# Altium project E17-12_CC.PrjPcb
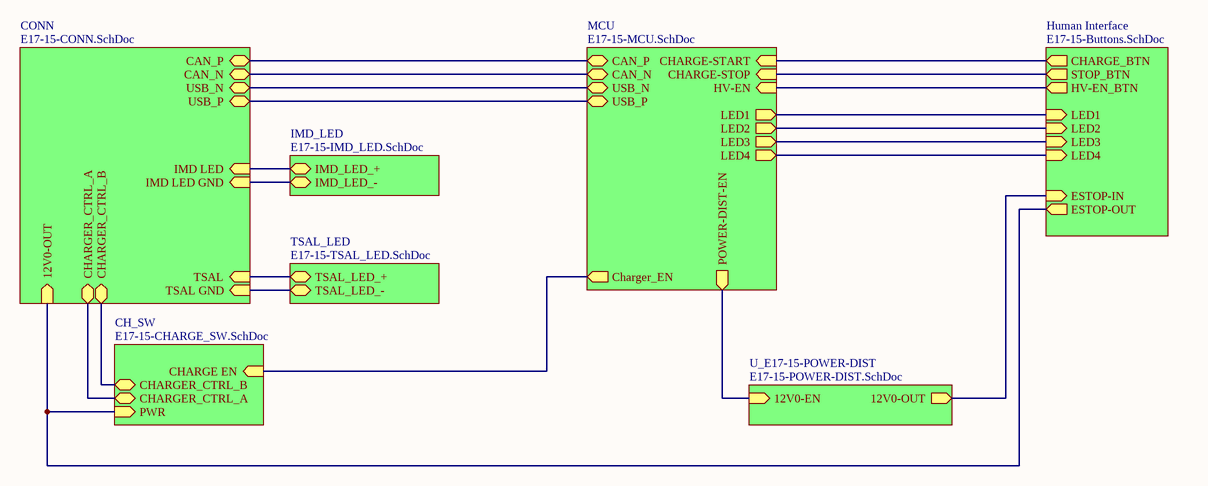
[diagram p0: E17-15-Charge_Cart.SchDoc]
9 sheets, 54 parts. Net scope: hierarchical (ports join the sheet entries above them; power ports are global).
Board file: E17-15-Charge_Cart.PcbDoc
Sheets:
  E17-15-Charge_Cart.SchDoc
    MCU = E17-15-MCU.SchDoc
    CONN = E17-15-CONN.SchDoc
    CH_SW = E17-15-CHARGE_SW.SchDoc
      SW = E17-04-INDUCTIVE_LOAD_SWITCH.SchDoc
    TSAL_LED = E17-15-TSAL_LED.SchDoc
    IMD_LED = E17-15-IMD_LED.SchDoc
    Human Interface = E17-15-Buttons.SchDoc
    U_E17-15-POWER-DIST = E17-15-POWER-DIST.SchDoc
      SW = E17-04-INDUCTIVE_LOAD_SWITCH.SchDoc

## Sheet E17-15-Charge_Cart.SchDoc
size A

### Sub-sheets
CH_SW = E17-15-CHARGE_SW.SchDoc: CHARGE EN (in), CHARGER_CTRL_B (bidir), CHARGER_CTRL_A (bidir), PWR (in)
CONN = E17-15-CONN.SchDoc: IMD LED (in), CAN_P (bidir), CAN_N (bidir), IMD LED GND (in), TSAL GND (in), TSAL (in), CHARGER_CTRL_B (bidir), CHARGER_CTRL_A (bidir), USB_N (bidir), USB_P (bidir), 12V0-OUT (in)
Human Interface = E17-15-Buttons.SchDoc: CHARGE_BTN (out), STOP_BTN (out), HV-EN_BTN (out), ESTOP-IN (in), ESTOP-OUT (out), LED1 (in), LED2 (in), LED3 (in), LED4 (in)
IMD_LED = E17-15-IMD_LED.SchDoc: IMD_LED_+ (bidir), IMD_LED_- (bidir)
MCU = E17-15-MCU.SchDoc: CAN_N (bidir), USB_N (bidir), USB_P (bidir), CAN_P (bidir), Charger_EN (out), CHARGE-STOP (in), HV-EN (in), CHARGE-START (in), POWER-DIST-EN (out), LED1 (out), LED2 (out), LED3 (out), LED4 (out)
TSAL_LED = E17-15-TSAL_LED.SchDoc: TSAL_LED_- (bidir), TSAL_LED_+ (bidir)
U_E17-15-POWER-DIST = E17-15-POWER-DIST.SchDoc: 12V0-OUT (out), 12V0-EN (in)

### Nets
CAN_N: sheet MCU/CAN_N, sheet CONN/CAN_N
CAN_P: sheet MCU/CAN_P, sheet CONN/CAN_P
USB_N: sheet MCU/USB_N, sheet CONN/USB_N
USB_P: sheet MCU/USB_P, sheet CONN/USB_P
NetCONTROL1_SW2_1: sheet MCU/POWER-DIST-EN, sheet U_E17-15-POWER-DIST/12V0-EN
NetD1_SW1_1: sheet CONN/12V0-OUT, sheet CH_SW/PWR, sheet Human Interface/ESTOP-OUT
NetD3_2: sheet CONN/IMD LED GND, sheet IMD_LED/IMD_LED_-
NetD4_2: sheet CONN/TSAL GND, sheet TSAL_LED/TSAL_LED_-
NetJ1_1: sheet CONN/CHARGER_CTRL_A, sheet CH_SW/CHARGER_CTRL_A
NetJ3_1: sheet Human Interface/ESTOP-IN, sheet U_E17-15-POWER-DIST/12V0-OUT
NetJ6_2: sheet CONN/IMD LED, sheet IMD_LED/IMD_LED_+
NetJ6_3: sheet CONN/TSAL, sheet TSAL_LED/TSAL_LED_+
NetJ6_10: sheet CONN/CHARGER_CTRL_B, sheet CH_SW/CHARGER_CTRL_B
NetPB1_40: sheet MCU/LED4, sheet Human Interface/LED4
NetPB1_42: sheet MCU/LED3, sheet Human Interface/LED3
NetPB1_44: sheet MCU/LED2, sheet Human Interface/LED2
NetPB1_46: sheet MCU/LED1, sheet Human Interface/LED1
(unnamed): sheet MCU/Charger_EN, sheet CH_SW/CHARGE EN
(unnamed): sheet MCU/CHARGE-STOP, sheet Human Interface/STOP_BTN
(unnamed): sheet MCU/HV-EN, sheet Human Interface/HV-EN_BTN
(unnamed): sheet MCU/CHARGE-START, sheet Human Interface/CHARGE_BTN

## Sheet E17-15-MCU.SchDoc
size A; DocumentNumber: 2; SheetNumber: 2; SheetTotal: 9
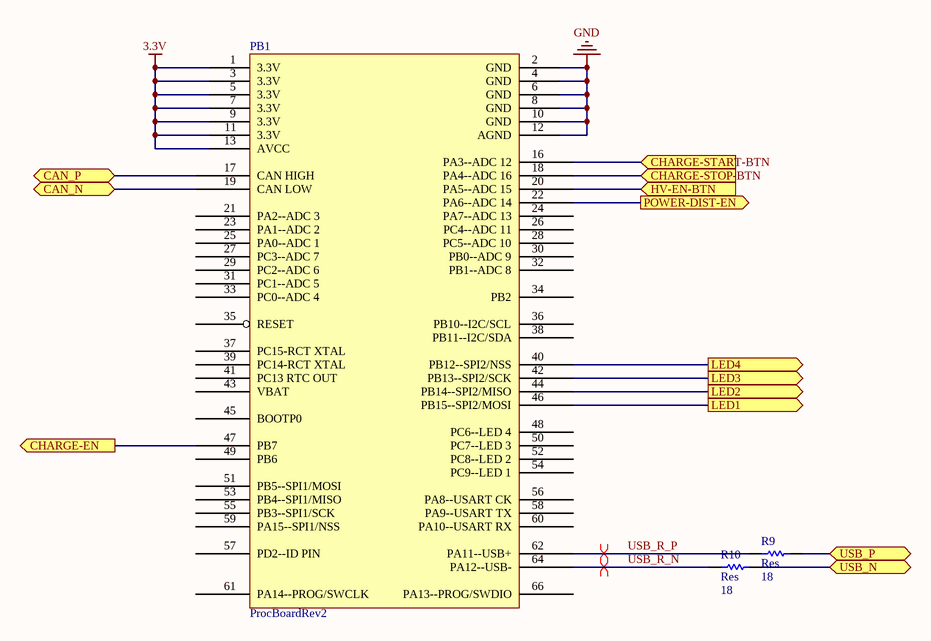
[diagram p1: E17-15-MCU.SchDoc]

### Parts
PB1  ProcBoardRev2  [PROC_BOARD]
R9  Res  value 18  [2012[0805]]
R10  Res  value 18  [2012[0805]]

### Ports
CAN_N (bidir), CAN_P (bidir), CHARGE-EN (out), CHARGE-START-BTN (in), CHARGE-STOP-BTN (in), HV-EN-BTN (in), LED1 (out), LED2 (out), LED3 (out), LED4 (out), POWER-DIST-EN (out), USB_N (bidir), USB_P (bidir)

### Nets
3.3V: PB1.1(3.3V) PB1.3(3.3V) PB1.5(3.3V) PB1.7(3.3V) PB1.9(3.3V) PB1.11(3.3V) PB1.13(AVCC)
GND: PB1.2(GND) PB1.4(GND) PB1.6(GND) PB1.8(GND) PB1.10(GND) PB1.12(AGND)
CAN_N: PB1.19(CAN_LOW) ; port CAN_N
CAN_P: PB1.17(CAN_HIGH) ; port CAN_P
USB_N: R10.2 ; port USB_N
USB_P: R9.2 ; port USB_P
USB_R_N: PB1.64(PA12--USB-) R10.1
USB_R_P: PB1.62(PA11--USB+) R9.1
NetCONTROL1_SW2_1: PB1.22(PA6--ADC_14) ; port POWER-DIST-EN
NetPB1_16: PB1.16(PA3--ADC_12) ; port CHARGE-START-BTN
NetPB1_18: PB1.18(PA4--ADC_16) ; port CHARGE-STOP-BTN
NetPB1_20: PB1.20(PA5--ADC_15) ; port HV-EN-BTN
NetPB1_40: PB1.40(PB12--SPI2/NSS) ; port LED4
NetPB1_42: PB1.42(PB13--SPI2/SCK) ; port LED3
NetPB1_44: PB1.44(PB14--SPI2/MISO) ; port LED2
NetPB1_46: PB1.46(PB15--SPI2/MOSI) ; port LED1
NetPB1_47: PB1.47(PB7) ; port CHARGE-EN

Not connected (* = marked no-connect by the designer): PB1 14(NC) 15(NC) 21(PA2--ADC_3) 23(PA1--ADC_2) 24(PA7--ADC_13) 25(PA0--ADC_1) 26(PC4--ADC_11) 27(PC3--ADC_7) 28(PC5--ADC_10) 29(PC2--ADC_6) 30(PB0--ADC_9) 31(PC1--ADC_5) 32(PB1--ADC_8) 33(PC0--ADC_4) 34(PB2) 35(RESET) 36(PB10--I2C/SCL) 37(PC15-RCT_XTAL) 38(PB11--I2C/SDA) 39(PC14-RCT_XTAL) 41(PC13_RTC_OUT) 43(VBAT) 45(BOOTP0) 48(PC6--LED_4) 49(PB6) 50(PC7--LED_3) 51(PB5--SPI1/MOSI) 52(PC8--LED_2) 53(PB4--SPI1/MISO) 54(PC9--LED_1) 55(PB3--SPI1/SCK) 56(PA8--USART_CK) 57(PD2--ID_PIN) 58(PA9--USART_TX) 59(PA15--SPI1/NSS) 60(PA10--USART_RX) 61(PA14--PROG/SWCLK) 63(NC) 65(NC) 66(PA13--PROG/SWDIO) 67

### Layout directives
differential pair: USB_R_N, USB_R_P

### Library data of the parts
PB1 = ProcBoardRev2: Processor board that carries the STM32F072RB
R9 R10 = Res: Surface Mount Resistor; Published: 8-Jun-2000; LatestRevisionDate: 17-Jul-2002; LatestRevisionNote: Re-released for DXP Platform.; PackageReference: AXIAL-0.5; Publisher: Altium Limited

## Sheet E17-15-CONN.SchDoc
size A; DocumentNumber: 3; SheetNumber: 3; SheetTotal: 9
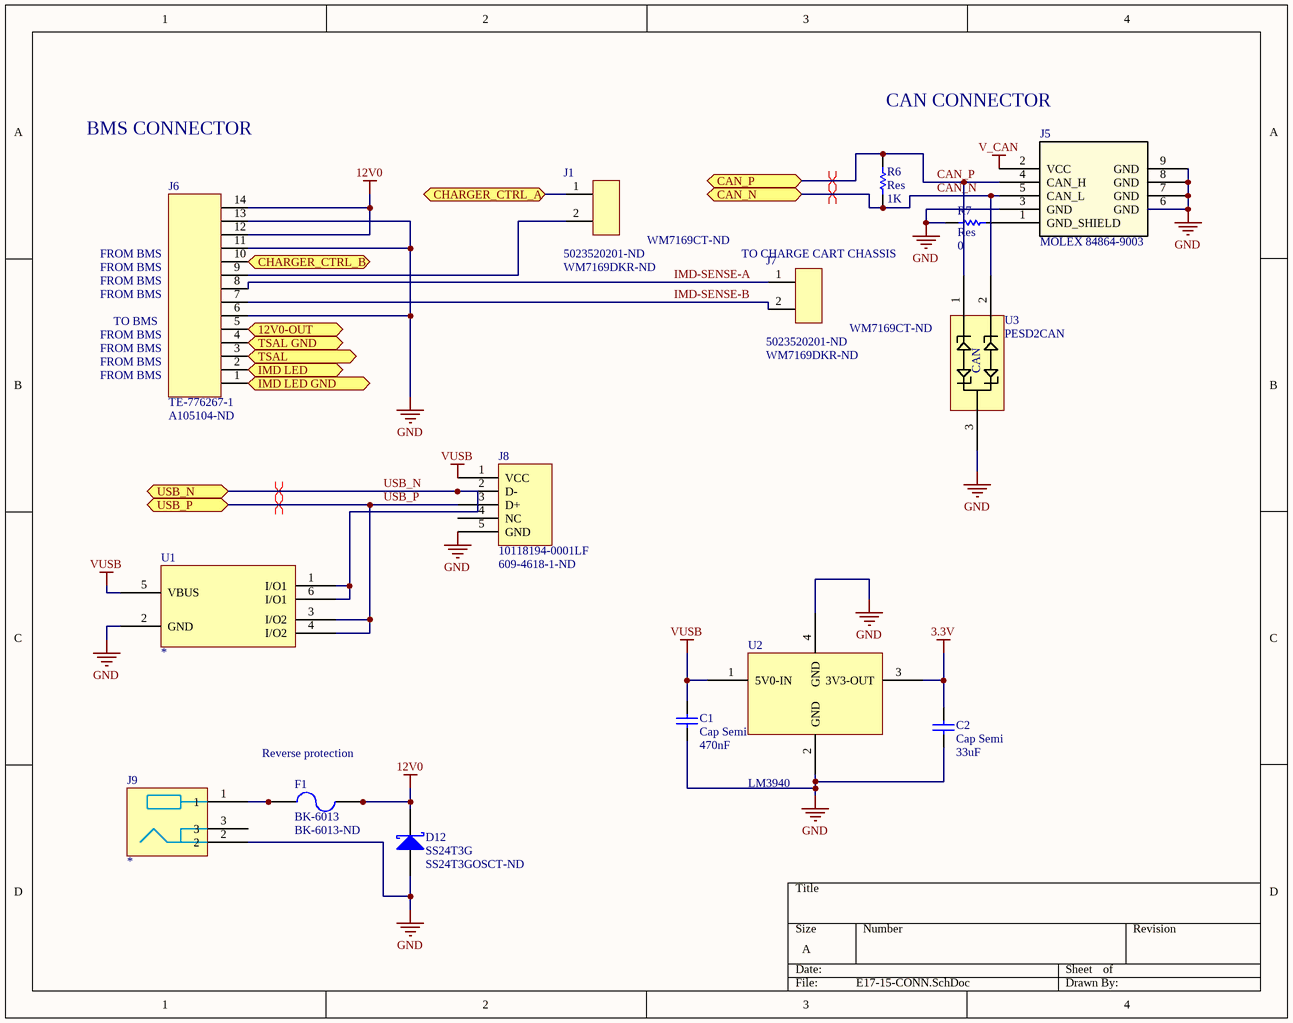
[diagram p2: E17-15-CONN.SchDoc]

### Parts
C1  Cap Semi  value 470nF  [C1206]
C2  Cap Semi  value 33uF  [C1206]
D12  SS24T3G  Supplier Part Number 1: SS24T3GOSCT-ND  [DO-214-AA]
F1  BK-6013  Supplier Part Number 1: BK-6013-ND  [BK-6013]
J1  Supplier Part Number 1: 5023520201-ND  Supplier Part Number 2: WM7169DKR-ND  [MOLEX_DURACLIK_2]  (hidden comment: J_5023520200)
J5  MOLEX 84864-9003  [MOLEX 84864-9003]
J6  TE-776267-1  Supplier Part Number 1: A105104-ND  [TE-776267-1]
J7  Supplier Part Number 1: 5023520201-ND  Supplier Part Number 2: WM7169DKR-ND  [MOLEX_DURACLIK_2]  (hidden comment: J_5023520200)
J8  10118194-0001LF  Supplier Part Number 1: 609-4618-1-ND  [10118194-0001LF]
J9  *  [EJ805A]
R6  Res  value 1K  [2012[0805]]
R7  Res  value 0  [2012[0805]]
U1  *  [SOP6]
U2  LM3940  [TO-263-3]
U3  PESD2CAN  [SOT95P230X110-3N]

### Ports
12V0-OUT (in), CAN_N (bidir), CAN_P (bidir), CHARGER_CTRL_A (bidir), CHARGER_CTRL_B (bidir), IMD LED (in), IMD LED GND (in), TSAL (in), TSAL GND (in), USB_N (bidir), USB_P (bidir)

### Nets
3.3V: C2.2 U2.3(3V3-OUT)
12V0: D12.2(K) F1.3 F1.4 J6.12 J6.14
GND: C1.1 C2.1 D12.1(A) J5.3(GND) J5.6(GND) J5.7(GND) J5.8(GND) J5.9(GND) J6.6 J6.11 J6.13 J8.5(GND) J9.2 R7.1 U1.2(GND) U2.2(GND) U2.4(GND) U3.3(COM)
V_CAN: J5.2(VCC)
VUSB: C1.2 J8.1(VCC) U1.5(VBUS) U2.1(5V0-IN)
CAN_N: J5.5(CAN_L) R6.1 U3.2(CATH2) ; port CAN_N
CAN_P: J5.4(CAN_H) R6.2 U3.1(CATH1) ; port CAN_P
IMD-SENSE-A: J6.8 J7.1
IMD-SENSE-B: J6.7 J7.2
USB_N: J8.2(D-) U1.1(I/O1) U1.6(I/O1) ; port USB_N
USB_P: J8.3(D+) U1.3(I/O2) U1.4(I/O2) ; port USB_P
NetD1_SW1_1: J6.5 ; port 12V0-OUT
NetD3_2: J6.1 ; port IMD LED GND
NetD4_2: J6.4 ; port TSAL GND
NetF1_1: F1.1 F1.2 J9.1
NetJ1_1: J1.1 ; port CHARGER_CTRL_A
NetJ1_2: J1.2 J6.9
NetJ5_1: J5.1(GND_SHIELD) R7.2
NetJ6_2: J6.2 ; port IMD LED
NetJ6_3: J6.3 ; port TSAL
NetJ6_10: J6.10 ; port CHARGER_CTRL_B

Not connected (* = marked no-connect by the designer): J8 4(NC); J9 3

### Layout directives
differential pair: CAN_N, CAN_P, USB_N, USB_P

### Notes on the sheet
- BMS CONNECTOR
- CAN CONNECTOR
- FROM BMS
- (near J7) TO CHARGE CART CHASSIS
- TO BMS
- (near F1) Reverse protection
- (in symbol PESD2CAN) CAN

### Library data of the parts
C1 C2 = Cap Semi: Capacitor (Semiconductor SIM Model); Published: 8-Jun-2000; LatestRevisionDate: 29-May-2009; LatestRevisionNote: IPC-7351 Footprint Added.; PackageReference: C1206; Publisher: Altium Limited; PackageDescription: Chip Capacitor
D12 = SS24T3G: Schottky Diode; Published: 8-Jun-2000; LatestRevisionDate: 17-Jul-2002; LatestRevisionNote: Re-released for DXP Platform.; PackageReference: SMB; Publisher: Altium Limited; Code_JEDEC: DO-214-AA; Supplier 1: Digi-Key
F1 = BK-6013: FUSE HOLDER BLADE PCB; Supplier 1: Digi-Key
J1 J7 = J_5023520200: MOLEX DURACLIK 2-PIN RA; Digikey_PN: WM7169CT-ND; Supplier 1: Digi-Key; Supplier 2: Digi-Key
J5 = MOLEX 84864-9003: CAN Micro-Change M12, Right Angle, Male
J6 = TE-776267-1: CONN HEADER 14POS R/A TIN BLK; Supplier 1: Digi-Key
J8 = 10118194-0001LF: CONN USB MICRO B RECPT SMT R/A; Supplier 1: Digi-Key
J9 = EJ508A: CONN PWR JACK 2.1X5.5MM SOLDER
R6 R7 = Res: Surface Mount Resistor; Published: 8-Jun-2000; LatestRevisionDate: 17-Jul-2002; LatestRevisionNote: Re-released for DXP Platform.; PackageReference: AXIAL-0.5; Publisher: Altium Limited
U1 = USBL6-2

## Sheet E17-15-CHARGE_SW.SchDoc
size A; DocumentNumber: 4; SheetNumber: 4; SheetTotal: 9
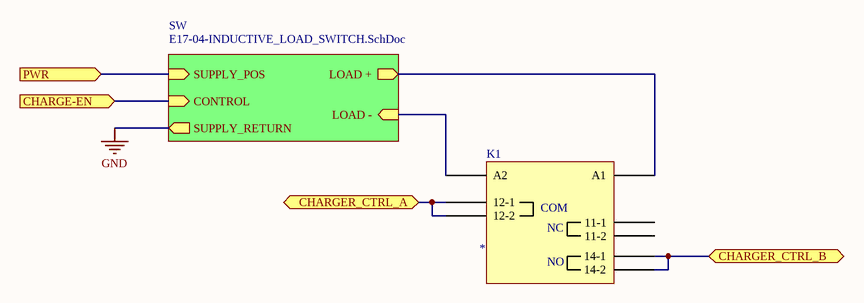
[diagram p3: E17-15-CHARGE_SW.SchDoc]

### Parts
K1  *  [TE-7-1393243-5]

### Sub-sheets
SW = E17-04-INDUCTIVE_LOAD_SWITCH.SchDoc: CONTROL (in), LOAD + (out), SUPPLY_POS (in), LOAD - (in), SUPPLY_RETURN (out)

### Ports
CHARGE-EN (in), CHARGER_CTRL_A (bidir), CHARGER_CTRL_B (bidir), PWR (in)

### Nets
NetCONTROL1_SW1_1: port CHARGE-EN, sheet SW/CONTROL
NetD1_SW1_1: K1.8(A1) ; port PWR, sheet SW/LOAD +, sheet SW/SUPPLY_POS
NetD2_SW1_1: K1.1(A2) ; sheet SW/LOAD -
NetJ1_1: K1.2(12-1) K1.7(12-2) ; port CHARGER_CTRL_A
NetJ6_10: K1.4(14-1) K1.5(14-2) ; port CHARGER_CTRL_B

Not connected (* = marked no-connect by the designer): K1 3(11-1) 6(11-2)

### Notes on the sheet
- (in symbol TE-1393240-3) COM; NC; NO

### Library data of the parts
K1 = TE-1393240-3: RELAY GEN PURPOSE SPDT 16A 110V

## Sheet E17-04-INDUCTIVE_LOAD_SWITCH.SchDoc
size A; DocumentNumber: 7; SheetNumber: 7; SheetTotal: 9
Used 2 times, as channels CH_SW/SW, U_E17-15-POWER-DIST/SW. Parts and nets are listed once, with the designators drawn on the sheet.
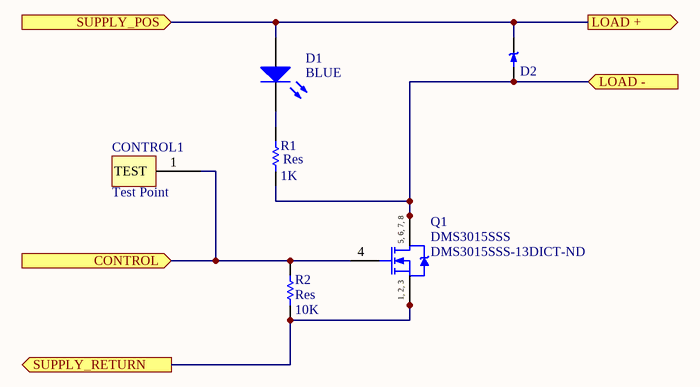
[diagram p4: E17-04-INDUCTIVE_LOAD_SWITCH.SchDoc]

### Parts
CONTROL1  Test Point  [TEST POINT 5000K]
D1  Colour: BLUE  [OVS5MBBCR4]  (hidden comment: OVS5MBBCR4)
D2  PMEG4010ET  [SOT23-3]  (value not drawn)
Q1  DMS3015SSS  Supplier Part Number 1: DMS3015SSS-13DICT-ND  [SOIC-8-150]
R1  Res  value 1K  [2012[0805]]
R2  Res  value 10K  [2012[0805]]

### Ports
CONTROL (in), LOAD + (out), LOAD - (in), SUPPLY_POS (in), SUPPLY_RETURN (out)

### Nets
CONTROL: CONTROL1.1(TEST) Q1.4(G) R2.2 ; port CONTROL
LOAD +: D1.1(A) D2.3 ; port SUPPLY_POS, port LOAD +
LOAD -: D2.1 Q1.5(D) Q1.6(D) Q1.7(D) Q1.8(D) R1.1 ; port LOAD -
SUPPLY_RETURN: Q1.1(S) Q1.2(S) Q1.3(S) R2.1 ; port SUPPLY_RETURN
NetD1_2: D1.2(K) R1.2

### Channels
CH_SW/SW: designators end in _SW1; ports CONTROL=NetCONTROL1_SW1_1 LOAD +=NetD1_SW1_1 LOAD -=NetD2_SW1_1 SUPPLY_POS=NetD1_SW1_1 SUPPLY_RETURN=GND
U_E17-15-POWER-DIST/SW: designators end in _SW2; ports CONTROL=NetCONTROL1_SW2_1 LOAD +=12V0 LOAD -=NetD2_SW2_1 SUPPLY_POS=12V0 SUPPLY_RETURN=GND

### Notes on the sheet
- (in symbol DMS3015SSS) 5, 6, 7, 8; 1, 2, 3

### Library data of the parts
CONTROL1 = Test Point: 5000-5004, 5015-5019 Keystone Electronics
D1 = OVS5MBBCR4: Typical BLUE LED; Published: 8-Jun-2000; LatestRevisionDate: 17-Jul-2002; LatestRevisionNote: Re-released for DXP Platform.; PackageDocument: Feb-2002; PackageReference: 3.2X1.6X1.1; Publisher: Altium Limited; Supplier 1: Digi-Key; Supplier Part Number 1: 365-1544-1-ND
D2 = PMEG4010ET: SCHOTTKY RECT 40V 1A SOT-23; Supplier 1: Digi-Key; Supplier Part Number 1: 568-4103-6-ND
Q1 = DMS3015SSS: N-Channel Power MOSFET; Supplier 1: Digi-Key
R1 R2 = Res: Surface Mount Resistor; Published: 8-Jun-2000; LatestRevisionDate: 17-Jul-2002; LatestRevisionNote: Re-released for DXP Platform.; PackageReference: AXIAL-0.5; Publisher: Altium Limited

## Sheet E17-15-TSAL_LED.SchDoc
size A
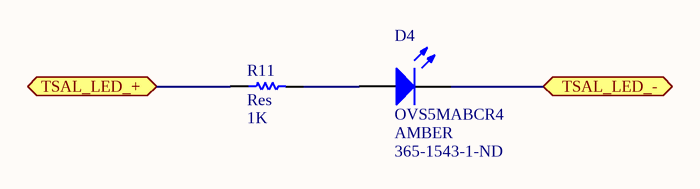
[diagram p5: E17-15-TSAL_LED.SchDoc]

### Parts
D4  OVS5MABCR4  Colour: AMBER  Supplier Part Number 1: 365-1543-1-ND  [OVS5MABCR4]
R11  Res  value 1K  [3216[1206]]

### Ports
TSAL_LED_+ (bidir), TSAL_LED_- (bidir)

### Nets
NetD4_1: D4.1(A) R11.2
NetD4_2: D4.2(K) ; port TSAL_LED_-
NetJ6_3: R11.1 ; port TSAL_LED_+

### Library data of the parts
D4 = OVS5MABCR4: Typical AMBER LED; Published: 8-Jun-2000; LatestRevisionDate: 17-Jul-2002; LatestRevisionNote: Re-released for DXP Platform.; PackageDocument: Feb-2002; PackageReference: 3.2X1.6X1.1; Publisher: Altium Limited; Supplier 1: Digi-Key
R11 = Res: Surface Mount Resistor; Published: 8-Jun-2000; LatestRevisionDate: 17-Jul-2002; LatestRevisionNote: Re-released for DXP Platform.; PackageReference: AXIAL-0.5; Publisher: Altium Limited

## Sheet E17-15-IMD_LED.SchDoc
size A
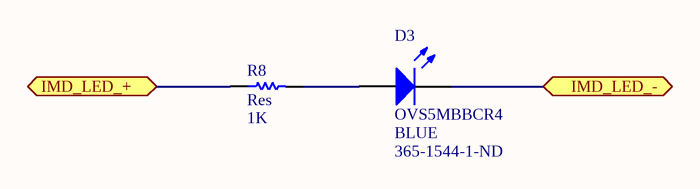
[diagram p6: E17-15-IMD_LED.SchDoc]

### Parts
D3  OVS5MBBCR4  Colour: BLUE  Supplier Part Number 1: 365-1544-1-ND  [OVS5MBBCR4]
R8  Res  value 1K  [3216[1206]]

### Ports
IMD_LED_+ (bidir), IMD_LED_- (bidir)

### Nets
NetD3_1: D3.1(A) R8.2
NetD3_2: D3.2(K) ; port IMD_LED_-
NetJ6_2: R8.1 ; port IMD_LED_+

### Library data of the parts
D3 = OVS5MBBCR4: Typical BLUE LED; Published: 8-Jun-2000; LatestRevisionDate: 17-Jul-2002; LatestRevisionNote: Re-released for DXP Platform.; PackageDocument: Feb-2002; PackageReference: 3.2X1.6X1.1; Publisher: Altium Limited; Supplier 1: Digi-Key
R8 = Res: Surface Mount Resistor; Published: 8-Jun-2000; LatestRevisionDate: 17-Jul-2002; LatestRevisionNote: Re-released for DXP Platform.; PackageReference: AXIAL-0.5; Publisher: Altium Limited

## Sheet E17-15-Buttons.SchDoc
size A; DocumentNumber: 6; SheetNumber: 6; SheetTotal: 9
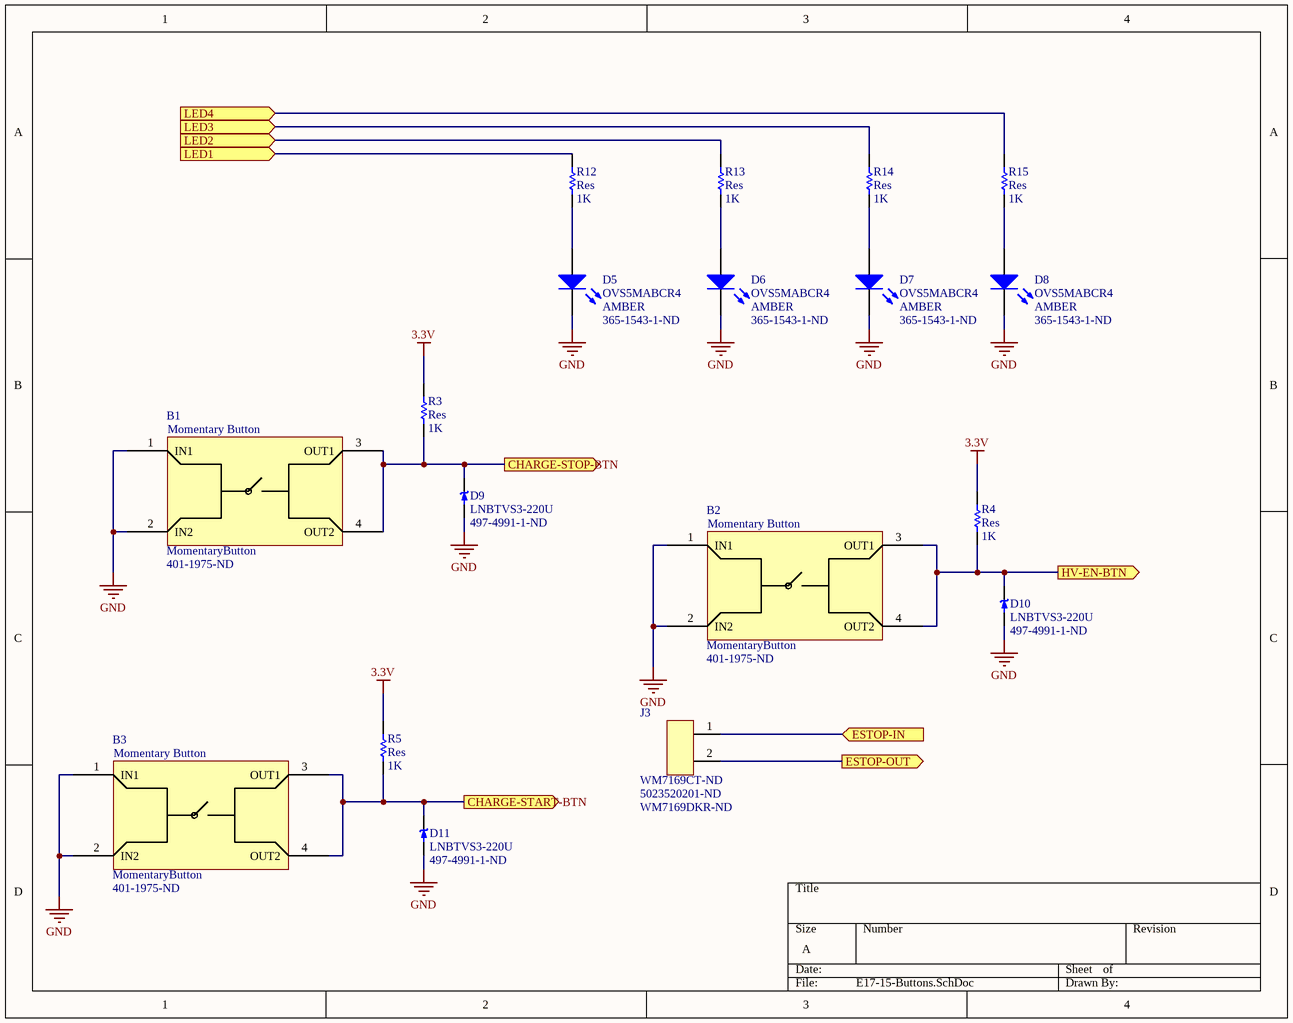
[diagram p7: E17-15-Buttons.SchDoc]

### Parts
B1  MomentaryButton  DigiKey Part Number: 401-1975-ND  [MomentaryButton]
B2  MomentaryButton  DigiKey Part Number: 401-1975-ND  [MomentaryButton]
B3  MomentaryButton  DigiKey Part Number: 401-1975-ND  [MomentaryButton]
D5  OVS5MABCR4  Colour: AMBER  Supplier Part Number 1: 365-1543-1-ND  [OVS5MABCR4]
D6  OVS5MABCR4  Colour: AMBER  Supplier Part Number 1: 365-1543-1-ND  [OVS5MABCR4]
D7  OVS5MABCR4  Colour: AMBER  Supplier Part Number 1: 365-1543-1-ND  [OVS5MABCR4]
D8  OVS5MABCR4  Colour: AMBER  Supplier Part Number 1: 365-1543-1-ND  [OVS5MABCR4]
D9  LNBTVS3-220U  Supplier Part Number 1: 497-4991-1-ND  [DO-214-AA]
D10  LNBTVS3-220U  Supplier Part Number 1: 497-4991-1-ND  [DO-214-AA]
D11  LNBTVS3-220U  Supplier Part Number 1: 497-4991-1-ND  [DO-214-AA]
J3  Supplier Part Number 1: 5023520201-ND  Supplier Part Number 2: WM7169DKR-ND  [MOLEX_DURACLIK_2]  (hidden comment: J_5023520200)
R3  Res  value 1K  [2012[0805]]
R4  Res  value 1K  [2012[0805]]
R5  Res  value 1K  [2012[0805]]
R12  Res  value 1K  [3216[1206]]
R13  Res  value 1K  [3216[1206]]
R14  Res  value 1K  [3216[1206]]
R15  Res  value 1K  [3216[1206]]

### Ports
CHARGE-START-BTN (out), CHARGE-STOP-BTN (out), ESTOP-IN (in), ESTOP-OUT (out), HV-EN-BTN (out), LED1 (in), LED2 (in), LED3 (in), LED4 (in)

### Nets
3.3V: R3.2 R4.2 R5.2
GND: B1.1(IN1) B1.2(IN2) B2.1(IN1) B2.2(IN2) B3.1(IN1) B3.2(IN2) D5.2(K) D6.2(K) D7.2(K) D8.2(K) D9.1 D10.1 D11.1
NetB1_3: B1.3(OUT1) B1.4(OUT2) D9.2 R3.1 ; port CHARGE-STOP-BTN
NetB2_3: B2.3(OUT1) B2.4(OUT2) D10.2 R4.1 ; port HV-EN-BTN
NetB3_3: B3.3(OUT1) B3.4(OUT2) D11.2 R5.1 ; port CHARGE-START-BTN
NetD1_SW1_1: J3.2 ; port ESTOP-OUT
NetD5_1: D5.1(A) R12.2
NetD6_1: D6.1(A) R13.2
NetD7_1: D7.1(A) R14.2
NetD8_1: D8.1(A) R15.2
NetJ3_1: J3.1 ; port ESTOP-IN
NetPB1_40: R15.1 ; port LED4
NetPB1_42: R14.1 ; port LED3
NetPB1_44: R13.1 ; port LED2
NetPB1_46: R12.1 ; port LED1

### Notes on the sheet
- (in symbol MomentaryButton) Momentary Button

### Library data of the parts
D5-D8 = OVS5MABCR4: Typical AMBER LED; Published: 8-Jun-2000; LatestRevisionDate: 17-Jul-2002; LatestRevisionNote: Re-released for DXP Platform.; PackageDocument: Feb-2002; PackageReference: 3.2X1.6X1.1; Publisher: Altium Limited; Supplier 1: Digi-Key
D9-D11 = LNBTVS3-220U: TVS DIODE 20VWM 35VC SMB; Supplier 1: Digi-Key
J3 = J_5023520200: MOLEX DURACLIK 2-PIN RA; Digikey_PN: WM7169CT-ND; Supplier 1: Digi-Key; Supplier 2: Digi-Key
R3-R5 R12-R15 = Res: Surface Mount Resistor; Published: 8-Jun-2000; LatestRevisionDate: 17-Jul-2002; LatestRevisionNote: Re-released for DXP Platform.; PackageReference: AXIAL-0.5; Publisher: Altium Limited

## Sheet E17-15-POWER-DIST.SchDoc
size A; DocumentNumber: 5; SheetNumber: 5; SheetTotal: 9
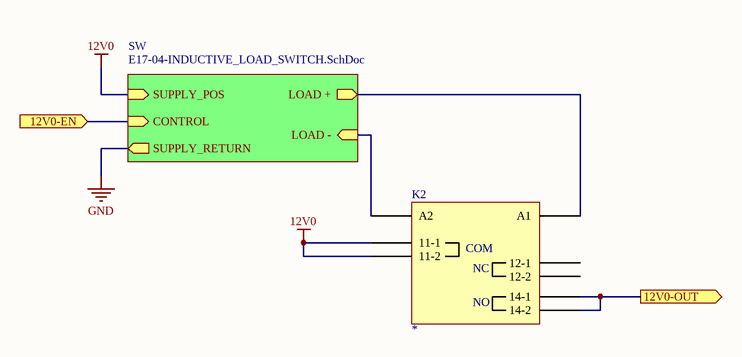
[diagram p8: E17-15-POWER-DIST.SchDoc]

### Parts
K2  *  [TE-7-1393243-5]

### Sub-sheets
SW = E17-04-INDUCTIVE_LOAD_SWITCH.SchDoc: CONTROL (in), LOAD + (out), SUPPLY_POS (in), LOAD - (in), SUPPLY_RETURN (out)

### Ports
12V0-EN (in), 12V0-OUT (out)

### Nets
12V0: K2.3(11-1) K2.6(11-2) K2.8(A1) ; sheet SW/LOAD +, sheet SW/SUPPLY_POS
NetCONTROL1_SW2_1: port 12V0-EN, sheet SW/CONTROL
NetD2_SW2_1: K2.1(A2) ; sheet SW/LOAD -
NetJ3_1: K2.4(14-1) K2.5(14-2) ; port 12V0-OUT

Not connected (* = marked no-connect by the designer): K2 2(12-1) 7(12-2)

### Notes on the sheet
- (in symbol TE-1393240-3) COM; NC; NO

### Library data of the parts
K2 = TE-1393240-3: RELAY GEN PURPOSE SPDT 16A 110V

## Nets that join several sheets
3.3V: E17-15-MCU (7 pins), E17-15-CONN (C2.2 U2.3), E17-15-Buttons (R3.2 R4.2 R5.2)
12V0: E17-15-CONN (5 pins), E17-15-POWER-DIST (K2.3 K2.6 K2.8), U_E17-15-POWER-DIST/SW (D1_SW2.1 D2_SW2.3)
GND: E17-15-MCU (6 pins), E17-15-CONN (18 pins), CH_SW/SW (Q1_SW1.1 Q1_SW1.2 Q1_SW1.3 R2_SW1.1), E17-15-Buttons (13 pins), U_E17-15-POWER-DIST/SW (Q1_SW2.1 Q1_SW2.2 Q1_SW2.3 R2_SW2.1)
CAN_N: E17-15-MCU (PB1.19), E17-15-CONN (J5.5 R6.1 U3.2)
CAN_P: E17-15-MCU (PB1.17), E17-15-CONN (J5.4 R6.2 U3.1)
NetCONTROL1_SW2_1: E17-15-MCU (PB1.22), U_E17-15-POWER-DIST/SW (CONTROL1_SW2.1 Q1_SW2.4 R2_SW2.2)
NetD1_SW1_1: E17-15-CONN (J6.5), E17-15-CHARGE_SW (K1.8), CH_SW/SW (D1_SW1.1 D2_SW1.3), E17-15-Buttons (J3.2)
NetD2_SW1_1: E17-15-CHARGE_SW (K1.1), CH_SW/SW (6 pins)
NetD2_SW2_1: E17-15-POWER-DIST (K2.1), U_E17-15-POWER-DIST/SW (6 pins)
NetD3_2: E17-15-CONN (J6.1), E17-15-IMD_LED (D3.2)
NetD4_2: E17-15-CONN (J6.4), E17-15-TSAL_LED (D4.2)
NetJ1_1: E17-15-CONN (J1.1), E17-15-CHARGE_SW (K1.2 K1.7)
NetJ3_1: E17-15-Buttons (J3.1), E17-15-POWER-DIST (K2.4 K2.5)
NetJ6_2: E17-15-CONN (J6.2), E17-15-IMD_LED (R8.1)
NetJ6_3: E17-15-CONN (J6.3), E17-15-TSAL_LED (R11.1)
NetJ6_10: E17-15-CONN (J6.10), E17-15-CHARGE_SW (K1.4 K1.5)
NetPB1_40: E17-15-MCU (PB1.40), E17-15-Buttons (R15.1)
NetPB1_42: E17-15-MCU (PB1.42), E17-15-Buttons (R14.1)
NetPB1_44: E17-15-MCU (PB1.44), E17-15-Buttons (R13.1)
NetPB1_46: E17-15-MCU (PB1.46), E17-15-Buttons (R12.1)
USB_N: E17-15-MCU (R10.2), E17-15-CONN (J8.2 U1.1 U1.6)
USB_P: E17-15-MCU (R9.2), E17-15-CONN (J8.3 U1.3 U1.4)